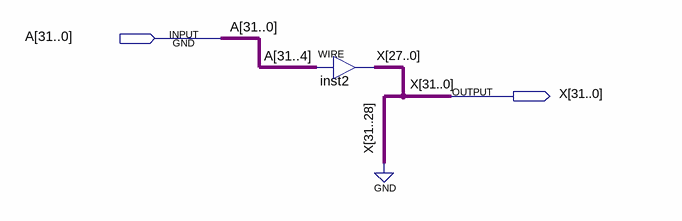
[diagram p0: schematic sheet]
// Quartus schematic shft4r32.bdf as structural Verilog: 1 symbols, 2 pins
module shft4r32 (
  input  [31:0] A,
  output [31:0] X
);

  assign X[27:0] = A[31:4];  // WIRE inst2

  assign X[31:28] = 4'b0000;
endmodule
